# EAGLE schematic SMD_Schaltplan (EAGLE 7.2.0)
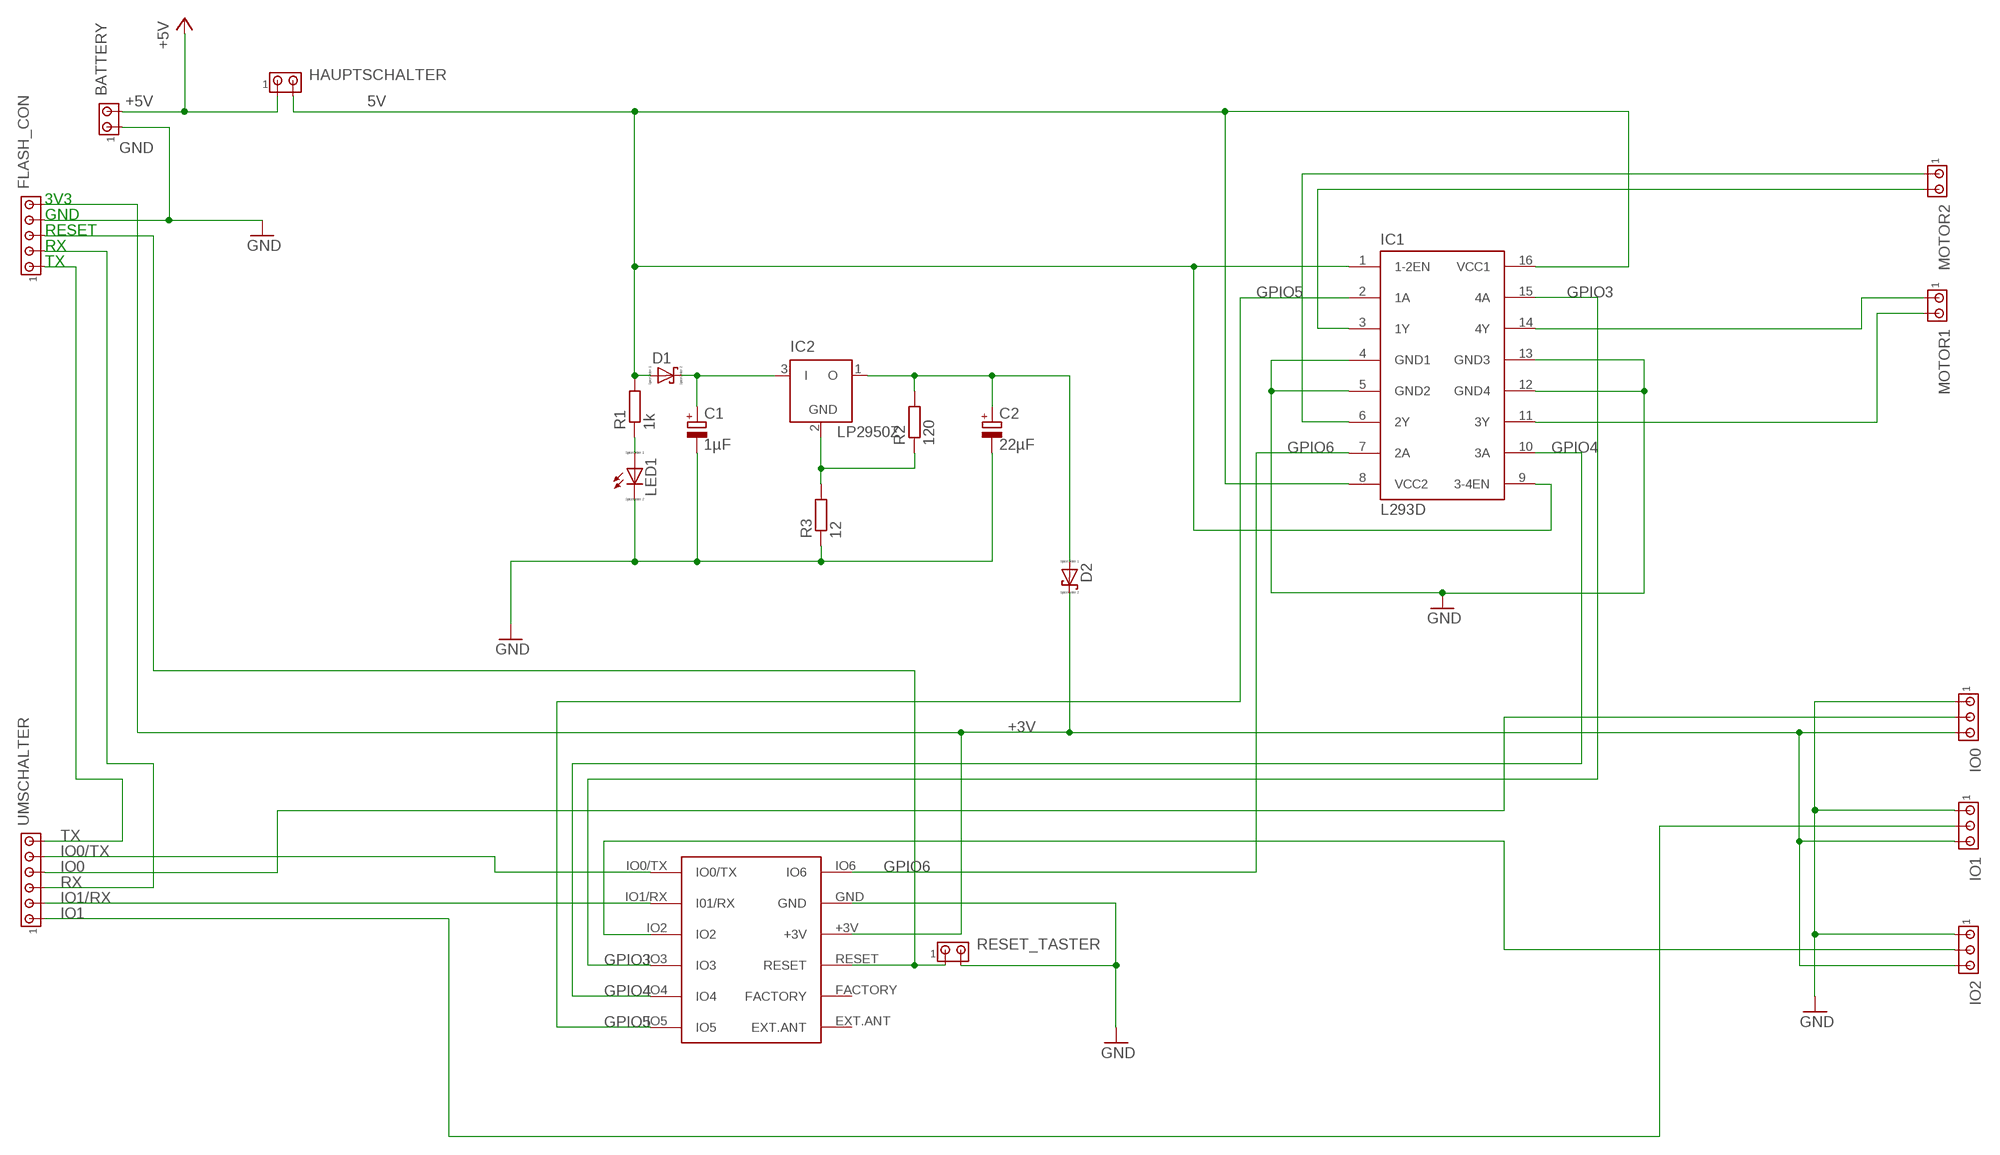
[diagram p0: schematic, sheet 1]

## Parts
BATTERY  MTA02-100  [10X02MTA]
C1  1µF  CPOL-EUE2,5-6E  [E2,5-6E]
C2  22µF  CPOL-EUE2,5-6E  [E2,5-6E]
D1  SCHOTTKY-DIODEDO35-7  [DIODE_DO35-7]
D2  SCHOTTKY-DIODEDO35-7  [DIODE_DO35-7]
FLASH_CON  MTA05-100  [10X05MTA]
HAUPTSCHALTER  MTA02-100  [10X02MTA]
IC1  L293D  [DIL16]
IC2  LP2950Z  [TO92]
IO0  MTA03-100  [10X03MTA]
IO1  MTA03-100  [10X03MTA]
IO2  MTA03-100  [10X03MTA]
LED1  LED_ELD260  [LED_LD260]
MOTOR1  MTA02-100  [10X02MTA]
MOTOR2  MTA02-100  [10X02MTA]
R1  1k  R-EU_0207/10  [0207/10]
R2  120  R-EU_0207/10  [0207/10]
R3  12  R-EU_0207/10  [0207/10]
RESET_TASTER  MTA02-100  [10X02MTA]
U$1  SMD_RFDUINO  [RFDUINO_SMD]
UMSCHALTER  MTA06-100  [10X06MTA]

## Nets
5V: D1.A(C) HAUPTSCHALTER.2 IC1.1(1-2EN) IC1.8(VCC2) IC1.9(3-4EN) IC1.16(VCC1) R1.2
+3V: D2.C(A) FLASH_CON.5 IO0.3 IO1.3 IO2.3 U$1.+3V
+5V: BATTERY.2 HAUPTSCHALTER.1
GND: BATTERY.1 C1.- C2.- FLASH_CON.4 IC1.4(GND1) IC1.5(GND2) IC1.12(GND4) IC1.13(GND3) IO0.1 IO1.1 IO2.1 LED1.K(C) R3.1 RESET_TASTER.2 U$1.GND
GPIO3: IC1.15(4A) U$1.IO3
GPIO4: IC1.10(3A) U$1.IO4
GPIO5: IC1.2(1A) U$1.IO5
GPIO6: IC1.7(2A) U$1.IO6
IO0: IO0.2 UMSCHALTER.4
IO0/TX: U$1.IO0/TX UMSCHALTER.5
IO1: IO1.2 UMSCHALTER.1
IO1/RX: U$1.IO1/RX(I01/RX) UMSCHALTER.2
N$2: C1.+ D1.C(A) IC2.3(I)
N$5: LED1.A R1.1
N$7: IC1.6(2Y) MOTOR2.1
N$9: IC1.3(1Y) MOTOR2.2
N$10: IC2.2(GND) R2.1 R3.2
N$11: IC1.11(3Y) MOTOR1.2
N$12: IC1.14(4Y) MOTOR1.1
N$15: FLASH_CON.3 RESET_TASTER.1 U$1.RESET
N$17: C2.+ D2.A(C) IC2.1(O) R2.2
N$20: IO2.2 U$1.IO2
RX: FLASH_CON.2 UMSCHALTER.3
TX: FLASH_CON.1 UMSCHALTER.6
Unconnected: U$1.EXT.ANT U$1.FACTORY

## Notes on the sheet
- 3V3
- GND
- RESET
- RX
- TX

## Library data of the parts
BATTERY HAUPTSCHALTER MOTOR1 MOTOR2 RESET_TASTER = con-amp:MTA02-100: AMP connector
C1 C2 = rcl:CPOL-EU: POLARIZED CAPACITOR, European symbol
D1 D2 = eagle-ltspice:SCHOTTKY-DIODE: Schottky Diode; SPICEMODEL: NONE; SPICEPREFIX: D; SPICETYPE: diode
FLASH_CON = con-amp:MTA05-100: AMP connector
IC1 = st-microelectronics:L293D: PUSH-PULL 4 CHANNEL DRIVER; MPN: L293D; OC_FARNELL: 9589619; OC_NEWARK: 56P8249
IC2 = linear:LP2950: 100 mA, Low Power Low Dropout Voltage Regulator Source: http://www.onsemi.com/pub/Collateral/LP2950-D.PDF
IO0 IO1 IO2 = con-amp:MTA03-100: AMP connector
LED1 = eagle-ltspice:LED_E: LED Source: http://www.osram.convergy.de Source: www.luxeon.com Source: www.kingbright.com; SPICEMODEL: NONE; SPICEPREFIX: D; SPICETYPE: diode
R1 = resistor:R-EU_: RESISTOR, European symbol
R2 R3 = rcl:R-EU_: RESISTOR, European symbol
U$1 = RFDuino_SMD:SMD_RFDUINO
UMSCHALTER = con-amp:MTA06-100: AMP connector Connection corrected 2014-09-19